# EAGLE schematic FrontEnd (EAGLE 7.1.0)
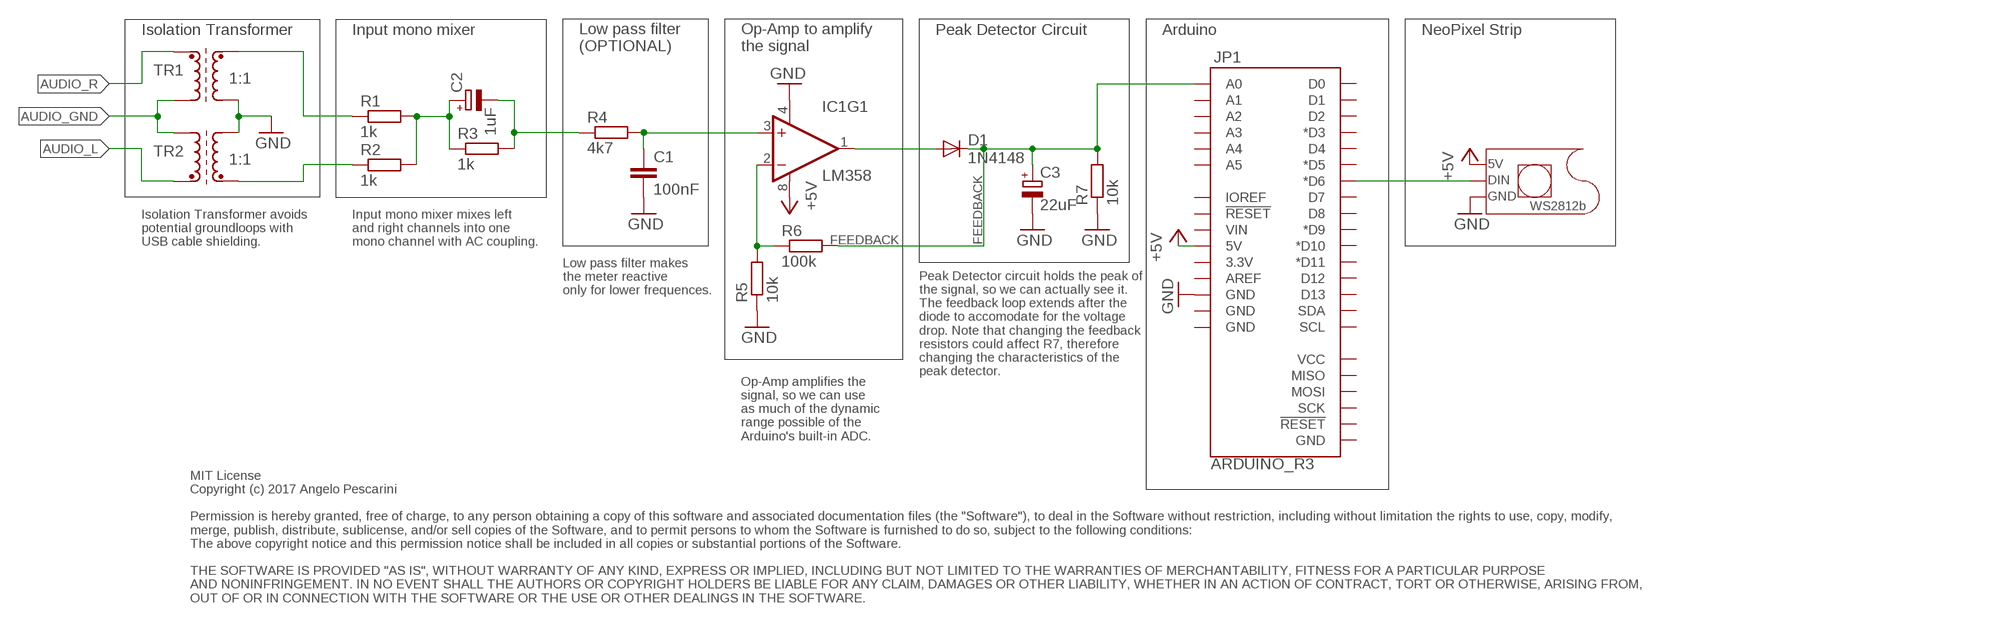
[diagram p0: schematic, sheet 1]

## Parts
C1  100nF  C-EU025-024X044  [C025-024X044]
C2  1uF  CPOL-EU085CS-1AR  [085CS_1AR]
C3  22uF  CPOL-EU085CS-1AR  [085CS_1AR]
D1  1N4148  1N4148DO35-10  [DO35-10]
IC1  LM358  [DIP08]
JP1  ARDUINO_R3  [ARDUINO_R3]
R1  1k  R-EU_0204/2V  [0204V]
R2  1k  R-EU_0204/2V  [0204V]
R3  1k  R-EU_0204/2V  [0204V]
R4  4k7  R-EU_0204/5  [0204/5]
R5  10k  R-EU_0204/2V  [0204V]
R6  100k  R-EU_0204/2V  [0204V]
R7  10k  R-EU_0204/2V  [0204V]
TR1  1:1  SM-T4  [SM-T4]
TR2  1:1  SM-T4  [SM-T4]

## Nets
+5V: IC1.8(V+) JP1.5V
AUDIO_GND: TR1.1(A1) TR1.5(A2) TR2.1(A1) TR2.5(A2) ; supply symbol labelled GND
AUDIO_L: TR2.2(E1)
AUDIO_R: TR1.4(E2)
FEEDBACK: C3.+ D1.C JP1.A0 R6.2 R7.2
GND: C1.2 C3.- IC1.4(V-) JP1.GND@4(GND) R5.1 R7.1
N$1: JP1.D6(*D6)
N$2: C2.- R3.2 R4.1
N$3: C1.1 IC1.3(+IN) R4.2
N$4: IC1.2(-IN) R5.2 R6.1
N$5: C2.+ R1.2 R2.2 R3.1
N$6: D1.A IC1.1(OUT)
N$7: R2.1 TR2.4(E2)
N$8: R1.1 TR1.2(E1)
Unconnected: IC1.5(+IN) IC1.6(-IN) IC1.7(OUT) JP1.3.3V JP1.A1 JP1.A2 JP1.A3 JP1.A4 JP1.A5 JP1.AREF JP1.D0 JP1.D1 JP1.D2 JP1.D3(*D3) JP1.D4 JP1.D5(*D5) JP1.D7 JP1.D8 JP1.D9(*D9) JP1.D10(*D10) JP1.D11(*D11) JP1.D12 JP1.D13 JP1.GND@1(GND) JP1.GND@2(GND) JP1.GND@3(GND) JP1.IOREF JP1.MISO JP1.MOSI JP1.RESET@1(!RESET!) JP1.RESET@2(!RESET!) JP1.SCK JP1.SCL JP1.SDA JP1.VCC JP1.VIN

## Notes on the sheet
- Isolation Transformer | Input mono mixer | Peak Detector Circuit | Arduino | NeoPixel Strip
- Low pass filter
  (OPTIONAL)
- Op-Amp to amplify
  the signal
- 5V
- DIN
- GND
- WS2812b
- Isolation Transformer avoids
  potential groundloops with
  USB cable shielding.
- Input mono mixer mixes left
  and right channels into one
  mono channel with AC coupling.
- Low pass filter makes
  the meter reactive
  only for lower frequences.
- Peak Detector circuit holds the peak of
  the signal, so we can actually see it.
  The feedback loop extends after the
  diode to accomodate for the voltage
  drop. Note that changing the feedback
  resistors could affect R7, therefore
  changing the characteristics of the
  peak detector.
- Op-Amp amplifies the
  signal, so we can use
  as much of the dynamic
  range possible of the
  Arduino's built-in ADC.
- MIT License
  Copyright (c) 2017 Angelo Pescarini
  
  Permission is hereby granted, free of charge, to any person obtaining a copy of this software and associated documentation files (the "Software"), to deal in the Software without restriction, including without limitation the rights to use, copy, modify,
  merge, publish, distribute, sublicense, and/or sell copies of the Software, and to permit persons to whom the Software is furnished to do so, subject to the following conditions:
  The above copyright notice and this permission notice shall be included in all copies or substantial portions of the Software.
  
  THE SOFTWARE IS PROVIDED "AS IS", WITHOUT WARRANTY OF ANY KIND, EXPRESS OR IMPLIED, INCLUDING BUT NOT LIMITED TO THE WARRANTIES OF MERCHANTABILITY, FITNESS FOR A PARTICULAR PURPOSE
  AND NONINFRINGEMENT. IN NO EVENT SHALL THE AUTHORS OR COPYRIGHT HOLDERS BE LIABLE FOR ANY CLAIM, DAMAGES OR OTHER LIABILITY, WHETHER IN AN ACTION OF CONTRACT, TORT OR OTHERWISE, ARISING FROM,
  OUT OF OR IN CONNECTION WITH THE SOFTWARE OR THE USE OR OTHER DEALINGS IN THE SOFTWARE.

## Library data of the parts
C1 = rcl:C-EU: CAPACITOR, European symbol
C2 C3 = rcl:CPOL-EU: POLARIZED CAPACITOR, European symbol
D1 = diode:1N4148: DIODE high speed (Philips)
IC1 = SparkFun-AnalogIC:LM358: Jellybean op-amp; PROD_ID: IC-09172
JP1 = SparkFun-Boards:ARDUINO_R3: Arduino R3 Footprint (w/ SPI header)
R1-R7 = rcl:R-EU_: RESISTOR, European symbol
TR1 TR2 = inductor-neosid:SM-T4: TRANSFORMER SMD wideband transformer; OC_FARNELL: unknown; OC_NEWARK: unknown